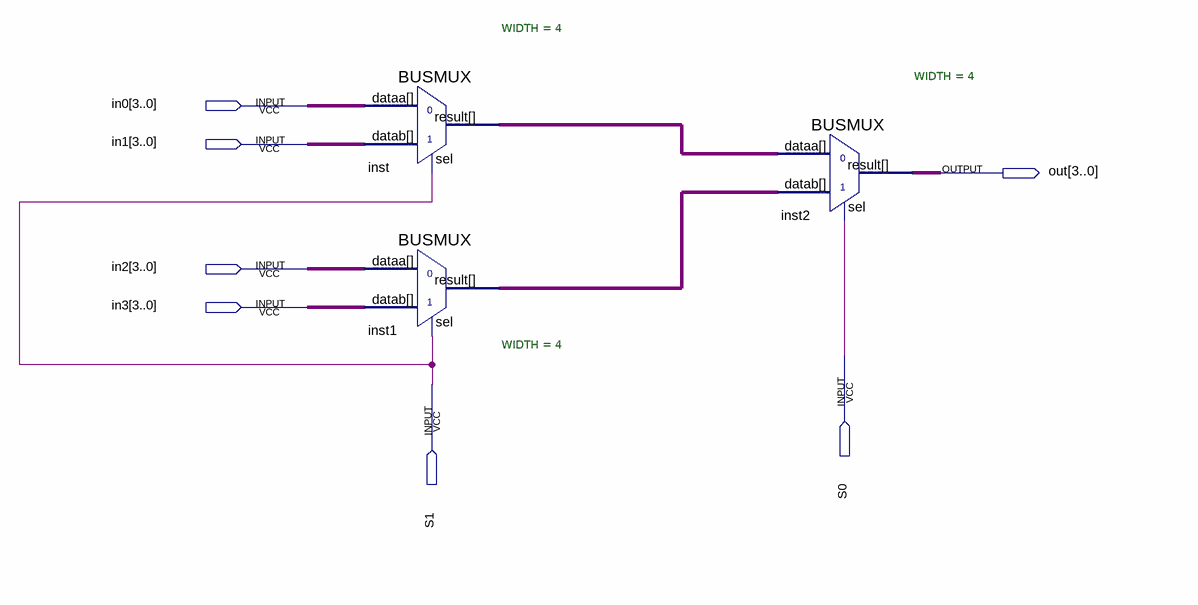
[diagram p0: schematic sheet]
// Quartus schematic MUX.bdf as structural Verilog: 3 symbols, 7 pins
module MUX (
  input  [3:0] in0,
  input  [3:0] in1,
  input  [3:0] in2,
  input  [3:0] in3,
  input  S0,
  input  S1,
  output [3:0] out
);

  wire [3:0] inst1_result, inst_result;

  BUSMUX #(.WIDTH(4)) inst (.datab(in1), .sel(S1), .dataa(in0), .result(inst_result));
  BUSMUX #(.WIDTH(4)) inst1 (.datab(in3), .sel(S1), .dataa(in2), .result(inst1_result));
  BUSMUX #(.WIDTH(4)) inst2 (.datab(inst1_result), .sel(S0), .dataa(inst_result), .result(out));
endmodule
